# EAGLE design shieldHub (EAGLE 9.6.2)
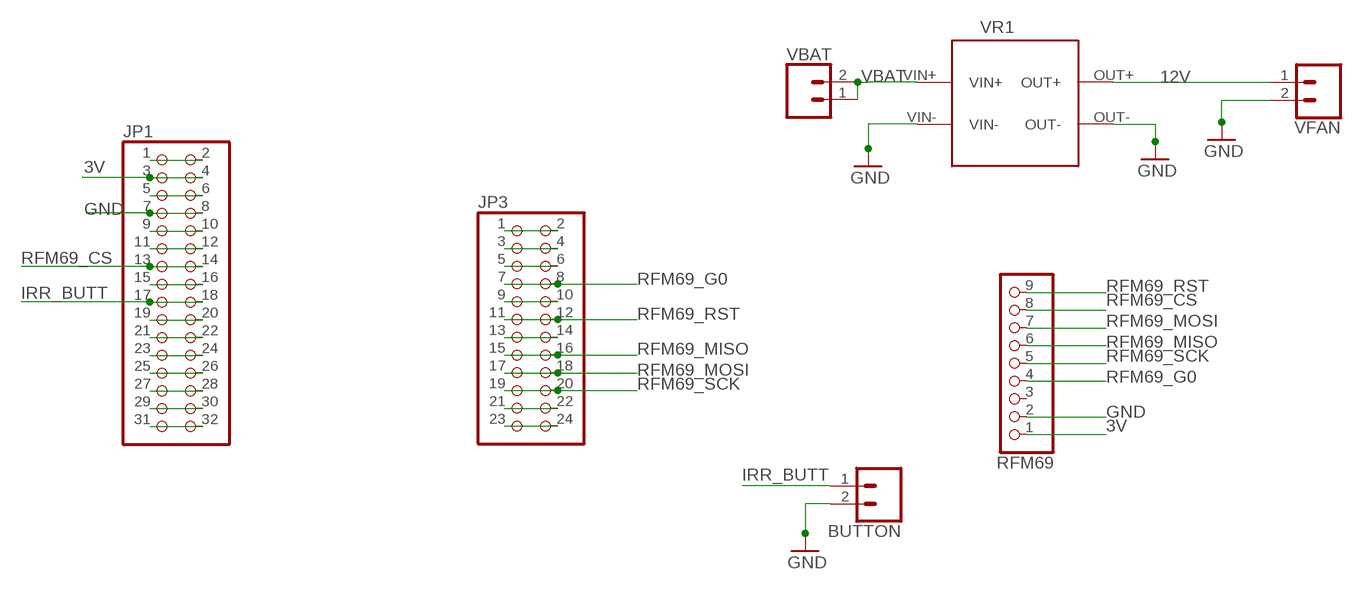
[diagram p0: schematic, sheet 1]

## Parts
BUTTON  CONN_023.5MM_LOCK  [SCREWTERMINAL-3.5MM-2_LOCK]
JP1  PINHD-2X16  [2X16]
JP3  PINHD-2X12  [2X12]
RFM69  PINHD-1X9  [1X09-BIG]
VBAT  CONN_02  [1X02]
VFAN  CONN_023.5MM_LOCK  [SCREWTERMINAL-3.5MM-2_LOCK]
VR1  MT3608THROUGH_HOLE  [MT3608]

## Nets
3V: JP1.3 JP1.4 RFM69.1
12V: VFAN.1 VR1.OUT+
GND: BUTTON.2 JP1.7 JP1.8 RFM69.2 VFAN.2 VR1.OUT- VR1.VIN-
IRR_BUTT: BUTTON.1 JP1.17 JP1.18
N$1: JP1.1 JP1.2
N$3: JP1.5 JP1.6
N$5: JP1.9 JP1.10
N$6: JP1.11 JP1.12
N$7: JP3.23 JP3.24
N$8: JP1.15 JP1.16
N$10: JP1.19 JP1.20
N$11: JP1.21 JP1.22
N$12: JP1.23 JP1.24
N$13: JP1.25 JP1.26
N$14: JP3.21 JP3.22
N$16: JP1.31 JP1.32
N$19: JP3.13 JP3.14
N$21: JP3.9 JP3.10
N$23: JP3.5 JP3.6
N$24: JP3.3 JP3.4
N$25: JP3.1 JP3.2
RFM69_CS: JP1.13 JP1.14 RFM69.8
RFM69_G0: JP3.7 JP3.8 RFM69.4
RFM69_MISO: JP3.15 JP3.16 RFM69.6
RFM69_MOSI: JP3.17 JP3.18 RFM69.7
RFM69_RST: JP3.11 JP3.12 RFM69.9
RFM69_SCK: JP3.19 JP3.20 RFM69.5
RX: JP1.27 JP1.28
TX: JP1.29 JP1.30
VBAT: VBAT.1 VBAT.2 VR1.VIN+
Unconnected: RFM69.3

## Library data of the parts
BUTTON VFAN = SparkFun-Connectors:CONN_02: Multi connection point. Often used as Generic Header-pin footprint for 0.1 inch spaced/style header connections On any of the 0.1 inch spaced packages, you can populate with these: Break Away Headers - Straight <https://www.sparkfun.com/products/116> (PRT-00116) Break Away Male Headers - Right Angle <https://www.sparkfun.com/products/553> (PRT-00553) Female Headers <https://www.sparkfun.com/products/115> (PRT-00115) Break Away Headers - Machine Pin <https://www.sparkfun.com/products/117> (PRT-00117) Break Away Female Headers - Swiss Machine Pin <https://www.sparkfun.com/products/743> (PRT-00743) For SCREWTERMINALS and SPRING TERMINALS visit here: Screw Terimnals on SparkFun.com <https://www.sparkfun.com/search/results?term=Screw+Terminals> (5mm/3.5mm/2.54mm spacing) This device is also useful as a general connection point to wire up your design to another part of your project. Our various solder wires solder well into these plated through hole pads. Hook-Up Wire - Assortment (Stranded, 22 AWG) <https://www.sparkfun.com/products/11375> (PRT-11375) Hook-Up Wire - Assortment (Solid Core, 22 AWG) <https://www.sparkfun.com/products/11367> (PRT-11367) View the entire wire category on our website here <https://www.sparkfun.com/categories/141> Special notes: Molex polarized connector foot print use with: PRT-08233 with associated crimp pins and housings. 2.54_SCREWTERM for use with PRT-10571. 3.5mm Screw Terminal footprints for PRT-08084 5mm Screw Terminal footprints for use with PRT-08432; PROD_ID: CONN-08399
JP1 = pinhead:PINHD-2X16: PIN HEADER
JP3 = pinhead:PINHD-2X12: PIN HEADER
RFM69 = adafruit:PINHD-1X9: Pin header 1x10 0.1" spacing With round pins
VBAT = SparkFun-Connectors:CONN_02: Multi connection point. Often used as Generic Header-pin footprint for 0.1 inch spaced/style header connections On any of the 0.1 inch spaced packages, you can populate with these: Break Away Headers - Straight <https://www.sparkfun.com/products/116> (PRT-00116) Break Away Male Headers - Right Angle <https://www.sparkfun.com/products/553> (PRT-00553) Female Headers <https://www.sparkfun.com/products/115> (PRT-00115) Break Away Headers - Machine Pin <https://www.sparkfun.com/products/117> (PRT-00117) Break Away Female Headers - Swiss Machine Pin <https://www.sparkfun.com/products/743> (PRT-00743) For SCREWTERMINALS and SPRING TERMINALS visit here: Screw Terimnals on SparkFun.com <https://www.sparkfun.com/search/results?term=Screw+Terminals> (5mm/3.5mm/2.54mm spacing) This device is also useful as a general connection point to wire up your design to another part of your project. Our various solder wires solder well into these plated through hole pads. Hook-Up Wire - Assortment (Stranded, 22 AWG) <https://www.sparkfun.com/products/11375> (PRT-11375) Hook-Up Wire - Assortment (Solid Core, 22 AWG) <https://www.sparkfun.com/products/11367> (PRT-11367) View the entire wire category on our website here <https://www.sparkfun.com/categories/141> Special notes: Molex polarized connector foot print use with: PRT-08233 with associated crimp pins and housings. 2.54_SCREWTERM for use with PRT-10571. 3.5mm Screw Terminal footprints for PRT-08084 5mm Screw Terminal footprints for use with PRT-08432
VR1 = lm2577_module:MT3608: This is the LM2577 device forMT3608 package with a usb connector

## Board
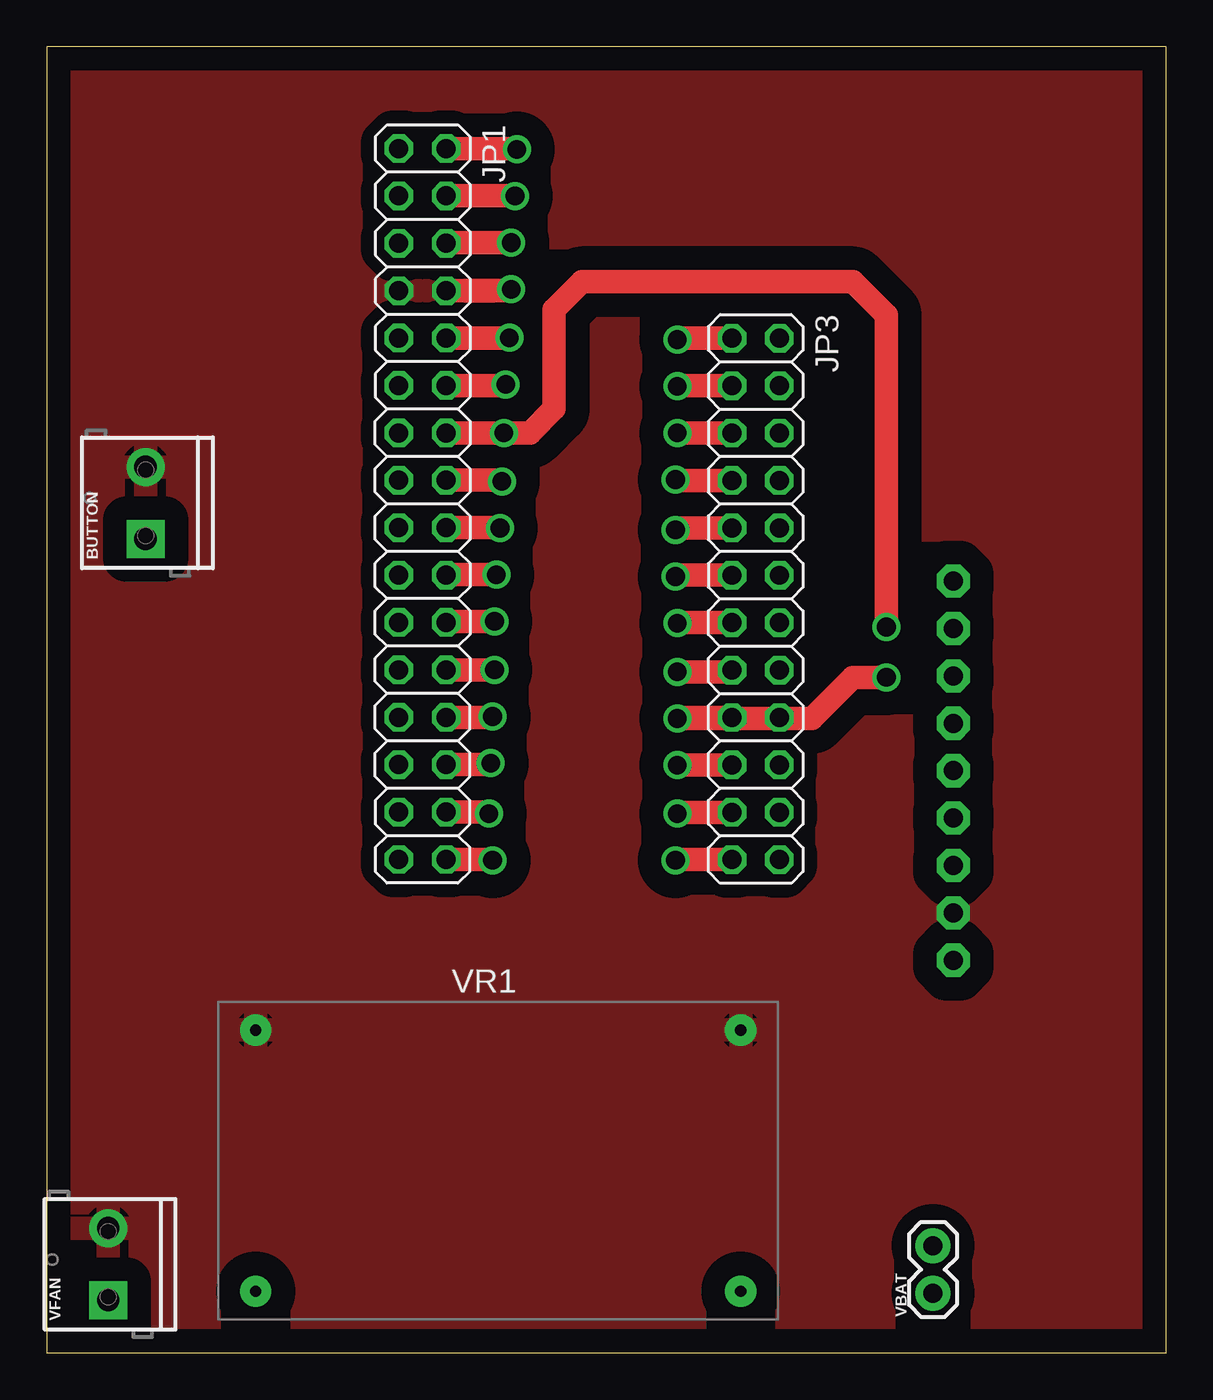
[diagram p1: board, top side]
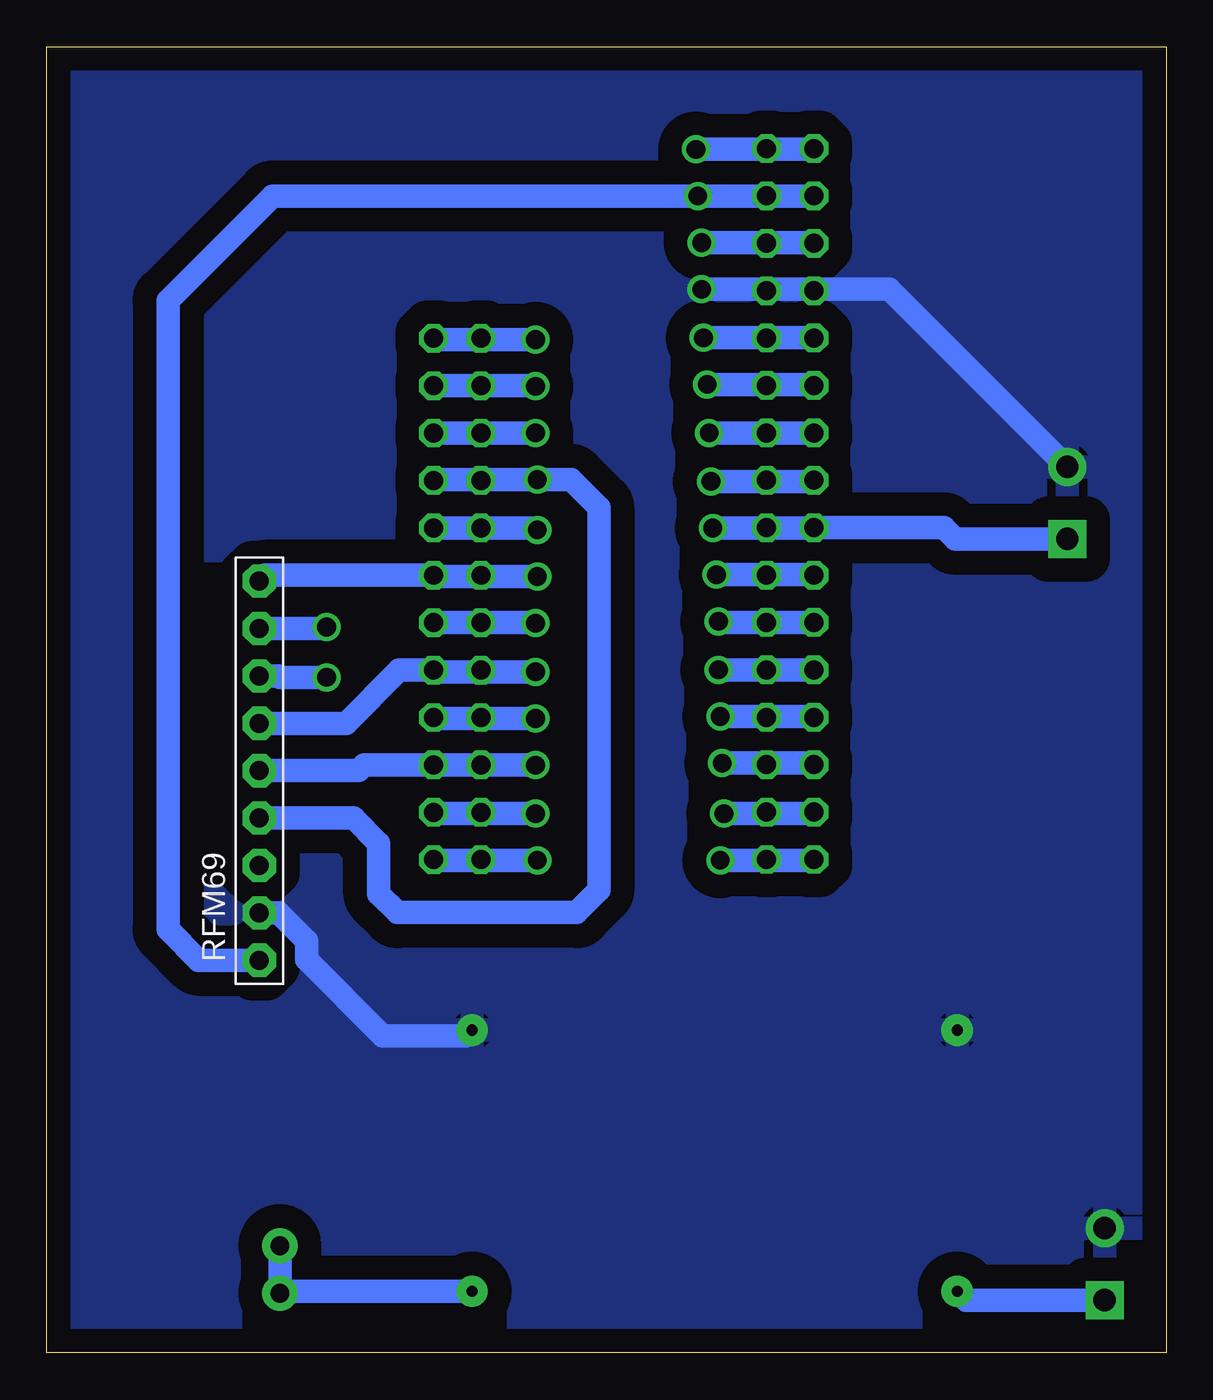
[diagram p2: board, bottom side, seen from below]

Size 60 x 70 mm. Coordinates in mm from the lower left corner, seen from the top.
Outline: 0,0 60,0 60,70 0,70 0,0
Copper layers (1*16): Top 0.035mm / dielectric 1.5mm / Bottom 0.035mm
Design rules "default *": minimum track width 6mil, minimum drill 0.35mm, track to track 1mm, track to pad 1mm, pad to pad 6mil, via to via 1mm, smd to smd 6mil, copper to edge 40mil, drill to drill 6mil, minimum pad ring 10mil, minimum via ring 8mil, stop-mask expansion 4mil, vias tented up to drill 0mil, thermal gap 10mil

### Footprints (pad centres in the part's own frame; a part is rotated, then mirrored left to right if it is on the bottom)
SCREWTERMINAL-3.5MM-2_LOCK = drill 1.2 pad 2.032 square: 1 -0.178,0 | drill 1.2 pad 2.032: 2 3.678,0
2X16 = drill 1.016 octagon: 1 -19.05,-1.27; 2 -19.05,1.27; 3 -16.51,-1.27; 4 -16.51,1.27; 5 -13.97,-1.27; 6 -13.97,1.27; 7 -11.43,-1.27; 8 -11.43,1.27; 9 -8.89,-1.27; 10 -8.89,1.27; 11 -6.35,-1.27; 12 -6.35,1.27; 13 -3.81,-1.27; 14 -3.81,1.27; 15 -1.27,-1.27; 16 -1.27,1.27; 17 1.27,-1.27; 18 1.27,1.27; 19 3.81,-1.27; 20 3.81,1.27; 21 6.35,-1.27; 22 6.35,1.27; 23 8.89,-1.27; 24 8.89,1.27; 25 11.43,-1.27; 26 11.43,1.27; 27 13.97,-1.27; 28 13.97,1.27; 29 16.51,-1.27; 30 16.51,1.27; 31 19.05,-1.27; 32 19.05,1.27
2X12 = drill 1.016 octagon: 1 -13.97,-1.27; 2 -13.97,1.27; 3 -11.43,-1.27; 4 -11.43,1.27; 5 -8.89,-1.27; 6 -8.89,1.27; 7 -6.35,-1.27; 8 -6.35,1.27; 9 -3.81,-1.27; 10 -3.81,1.27; 11 -1.27,-1.27; 12 -1.27,1.27; 13 1.27,-1.27; 14 1.27,1.27; 15 3.81,-1.27; 16 3.81,1.27; 17 6.35,-1.27; 18 6.35,1.27; 19 8.89,-1.27; 20 8.89,1.27; 21 11.43,-1.27; 22 11.43,1.27; 23 13.97,-1.27; 24 13.97,1.27
1X09-BIG = drill 1.016 pad 1.778 octagon: 1 -10.16,0; 2 -7.62,0; 3 -5.08,0; 4 -2.54,0; 5 0,0; 6 2.54,0; 7 5.08,0; 8 7.62,0; 9 10.16,0
1X02 = drill 1.016 pad 1.88: 1 0,0; 2 2.54,0
MT3608 = drill 0.6 pad 1.676: OUT+ 14,0; OUT- 0,0; VIN+ 14,26; VIN- 0,26

### Placement (x,y rotation side)
BUTTON  5.3,43.8 90 top
JP1  20.14,45.49 270 top
JP3  38,40.4 270 top
RFM69  48.6,31.2 90 bottom
VBAT  47.5,3.2 90 top
VFAN  3.3,3 90 top
VR1  11.2,17.3 270 top

### Tracks (layer width: path | path; a pad name or v marks a point on that pad's centre or on a via)
3V  (via drill 1 pad 1.3)
  Top 1.27: JP1.4 v25.1,62
  Bottom 1.27: JP1.3 v25.1,62 47.9,62 53.5,56.4 53.5,22.7 51.84,21.04 RFM69.1
12V
  Bottom 1.27: VFAN.1 10.72,2.82 VR1.OUT+
GND  (via drill 1 pad 1.3)
  Top 1.27: JP1.8 24.82,56.92 v24.9,57
  Bottom 1.27: v24.9,57 18.95,57 | 18.95,57 JP1.7 | BUTTON.2 14.82,57 18.95,57 | RFM69.2 48.58,23.56 47.55,23.56 46.08,22.09 46.08,21.08 42,17 37.5,17 VR1.VIN-
  pour Bottom (isolate 1.27): 0,0 60,0 60,70 0,70
  pour Top (isolate 1.27): 0,0 60,0 60,70 0,70
IRR_BUTT  (via drill 1 pad 1.3)
  Top 1.27: JP1.18 24.28,44.22 v24.3,44.2
  Bottom 1.27: v24.3,44.2 18.89,44.2 JP1.17 11.92,44.22 11.3,43.6 5.32,43.6 BUTTON.1
N$1  (via drill 1 pad 1.3)
  Top 1.27: JP1.2 25.16,64.54 v25.2,64.5
  Bottom 1.27: v25.2,64.5 18.91,64.5 JP1.1
N$3  (via drill 1 pad 1.3)
  Top 1.27: JP1.6 21.45,59.5 v24.9,59.5
  Bottom 1.27: v24.9,59.5 18.91,59.5 JP1.5
N$5  (via drill 1 pad 1.3)
  Top 1.27: JP1.10 24.78,54.38 v24.8,54.4
  Bottom 1.27: v24.8,54.4 18.89,54.4 JP1.9
N$6  (via drill 1 pad 1.3)
  Top 1.27: JP1.12 24.54,51.84 v24.6,51.9
  Bottom 1.27: v24.6,51.9 18.93,51.9 JP1.11
N$7  (via drill 1 pad 1.3)
  Top 1.27: JP3.23 33.73,26.43 v33.7,26.4
  Bottom 1.27: v33.7,26.4 39.24,26.4 JP3.24
N$8  (via drill 1 pad 1.3)
  Top 1.27: JP1.16 24.34,46.76 v24.4,46.7
  Bottom 1.27: v24.4,46.7 18.93,46.7 JP1.15
N$10  (via drill 1 pad 1.3)
  Top 1.27: JP1.20 21.43,41.7 v24.1,41.7
  Bottom 1.27: v24.1,41.7 18.89,41.7 JP1.19
N$11  (via drill 1 pad 1.3)
  Top 1.27: JP1.22 21.47,39.2 v24,39.2
  Bottom 1.27: v24,39.2 23.94,39.14 JP1.21
N$12  (via drill 1 pad 1.3)
  Top 1.27: JP1.24 v24,36.6
  Bottom 1.27: v24,36.6 JP1.23
N$13  (via drill 1 pad 1.3)
  Top 1.27: JP1.26 23.86,34.06 v23.9,34.1
  Bottom 1.27: v23.9,34.1 18.91,34.1 JP1.25
N$14  (via drill 1 pad 1.3)
  Top 1.27: JP3.21 33.87,28.97 v33.8,28.9
  Bottom 1.27: v33.8,28.9 39.2,28.9 JP3.22
N$16  (via drill 1 pad 1.3)
  Top 1.27: JP1.32 23.86,26.44 v23.9,26.4
  Bottom 1.27: v23.9,26.4 18.91,26.4 JP1.31
N$19  (via drill 1 pad 1.3)
  Top 1.27: JP3.13 33.83,39.13 v33.8,39.1
  Bottom 1.27: v33.8,39.1 33.83,39.13 JP3.14
N$21  (via drill 1 pad 1.3)
  Top 1.27: JP3.9 33.81,44.21 v33.7,44.1
  Bottom 1.27: v33.7,44.1 33.81,44.21 JP3.10
N$23  (via drill 1 pad 1.3)
  Top 1.27: JP3.5 v33.81,49.29 v33.8,49.3
  Bottom 1.27: v33.8,49.3 JP3.6
N$24  (via drill 1 pad 1.3)
  Top 1.27: JP3.3 33.83,51.83 v33.8,51.8
  Bottom 1.27: v33.8,51.8 33.83,51.83 JP3.4
N$25  (via drill 1 pad 1.3)
  Top 1.27: JP3.1 33.87,54.37 v33.8,54.3
  Bottom 1.27: v33.8,54.3 39.2,54.3 JP3.2
RFM69_CS  (via drill 1 pad 1.3)
  Top 1.27: JP1.14 v24.5,49.3 | v24.5,49.3 | v45,38.9 45,55.6 43.2,57.4 28.7,57.4 27.2,55.9 27.2,50.6 25.9,49.3 v24.5,49.3
  Bottom 1.27: v24.5,49.3 JP1.13 | RFM69.8 45.08,38.82 v45,38.9
RFM69_G0  (via drill 1 pad 1.3)
  Top 1.27: JP3.7 33.75,46.75 v33.7,46.8
  Bottom 1.27: JP3.8 39.22,46.8 v33.7,46.8 31.9,46.8 30.4,45.3 30.4,24.8 31.6,23.6 41.2,23.6 42.2,24.6 42.2,27.3 43.56,28.66 RFM69.4
RFM69_MISO  (via drill 1 pad 1.3)
  Top 1.27: JP3.15 36.64,36.5 v33.8,36.5
  Bottom 1.27: v33.8,36.5 39.18,36.5 JP3.16 41.11,36.59 43.96,33.74 RFM69.6
RFM69_MOSI  (via drill 1 pad 1.3)
  Top 1.27: JP3.17 33.85,34.05 v33.8,34 41,34 43.2,36.2 v45,36.2
  Bottom 1.27: v33.8,34 39.22,34 JP3.18 | v45,36.2 47.49,36.2 47.55,36.26 48.58,36.26 RFM69.7
RFM69_RST  (via drill 1 pad 1.3)
  Top 1.27: JP3.11 33.77,41.67 v33.7,41.6
  Bottom 1.27: v33.7,41.6 39.2,41.6 JP3.12 48.29,41.67 RFM69.9
RFM69_SCK  (via drill 1 pad 1.3)
  Top 1.27: JP3.19 v33.81,31.51 v33.8,31.5
  Bottom 1.27: v33.8,31.5 JP3.20 42.98,31.51 43.27,31.22 48.58,31.22 RFM69.5
RX  (via drill 1 pad 1.3)
  Top 1.27: JP1.28 23.72,31.52 v23.8,31.6
  Bottom 1.27: v23.8,31.6 18.95,31.6 JP1.27
TX  (via drill 1 pad 1.3)
  Top 1.27: JP1.30 23.62,28.98 v23.7,28.9
  Bottom 1.27: v23.7,28.9 18.95,28.9 JP1.29
VBAT
  Bottom 1.27: VR1.VIN+ 47.4,3.3 VBAT.1 VBAT.2